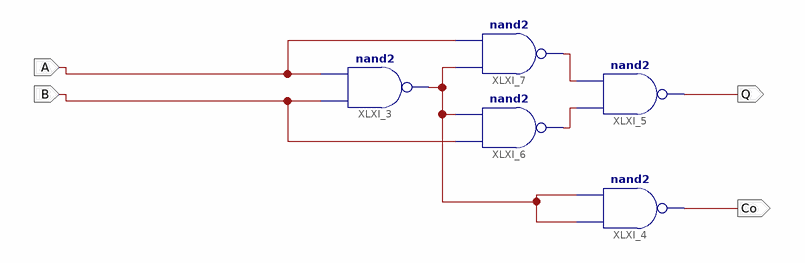
[diagram p0: schematic sheet 1]
// Xilinx ISE schematic example1.sch (spartan3e) as structural Verilog: 5 symbols, 4 ports
module example1 (
  input  A,
  input  B,
  output Q,
  output Co
);

  wire XLXN_16, XLXN_17, XLXN_23;

  nand XLXI_3 (XLXN_23, B, A);
  nand XLXI_4 (Co, XLXN_23, XLXN_23);
  nand XLXI_5 (Q, XLXN_17, XLXN_16);
  nand XLXI_6 (XLXN_17, B, XLXN_23);
  nand XLXI_7 (XLXN_16, XLXN_23, A);
endmodule
